# Altium schematic sheet Sheet1.SchDoc
size A2
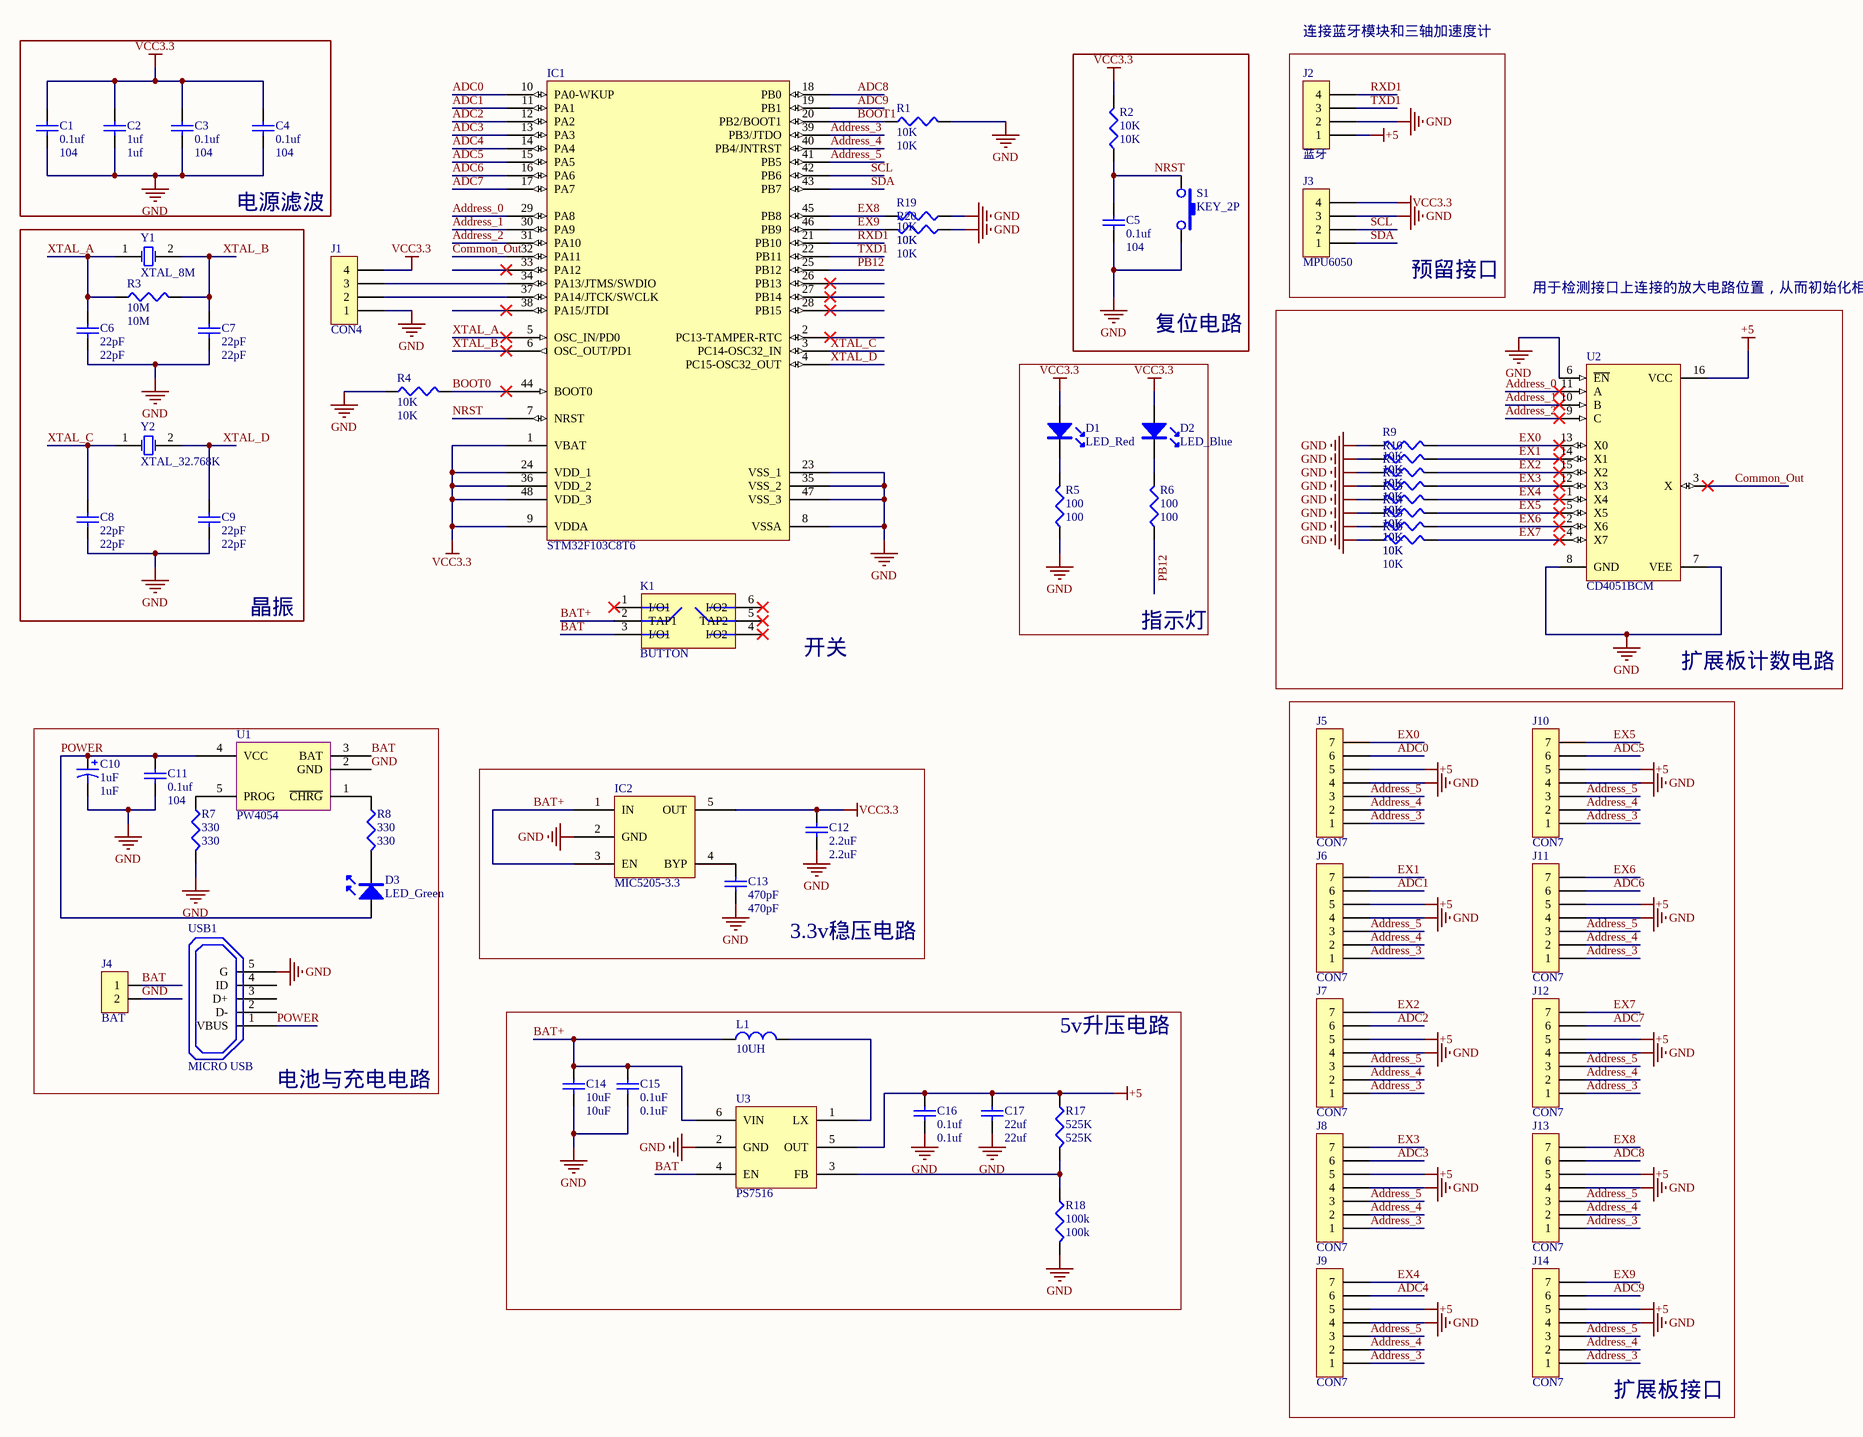
[diagram p0: Sheet1.SchDoc]

## Parts
C1  0.1uf  value 104  [6-0805_L]
C2  1uf  [6-0805_L]
C3  0.1uf  value 104  [6-0805_L]
C4  0.1uf  value 104  [6-0805_L]
C5  0.1uf  value 104  [6-0805_L]
C6  22pF  [6-0805_L]
C7  22pF  [6-0805_L]
C8  22pF  [6-0805_L]
C9  22pF  [6-0805_L]
C10  1uF  [C0805]
C11  0.1uf  value 104  [6-0805_L]
C12  2.2uF  [6-0805_L]
C13  470pF  [6-0805_L]
C14  10uF  [6-0805_L]
C15  0.1uF  [6-0805_L]
C16  0.1uf  [6-0805_L]
C17  22uf  [6-0805_L]
D1  LED_Red  [6-0805_M]
D2  LED_Blue  [6-0805_M]
D3  LED_Green  [6-0805_M]
IC1  STM32F103C8T6  [LQFP48]
IC2  MIC5205-3.3  [SOT-23-5]
J1  CON4  [HDR1X4]
J2  蓝牙  [HDR1X4]
J3  MPU6050  [HDR1X4]
J4  BAT  [HDR1X2]
J5  CON7  [HDR1X7]
J6  CON7  [HDR1X7]
J7  CON7  [HDR1X7]
J8  CON7  [HDR1X7]
J9  CON7  [HDR1X7]
J10  CON7  [HDR1X7]
J11  CON7  [HDR1X7]
J12  CON7  [HDR1X7]
J13  CON7  [HDR1X7]
J14  CON7  [HDR1X7]
K1  BUTTON  [switch]
L1  10UH  [0850]
R1  10K  [6-0805_L]
R2  10K  [6-0805_L]
R3  10M  [6-0805_L]
R4  10K  [6-0805_L]
R5  100  [6-0805_L]
R6  100  [6-0805_L]
R7  330  [6-0805_L]
R8  330  [6-0805_L]
R9  10K  [6-0805_L]
R10  10K  [6-0805_L]
R11  10K  [6-0805_L]
R12  10K  [6-0805_L]
R13  10K  [6-0805_L]
R14  10K  [6-0805_L]
R15  10K  [6-0805_L]
R16  10K  [6-0805_L]
R17  525K  [6-0805_L]
R18  100k  [6-0805_L]
R19  10K  [6-0805_L]
R20  10K  [6-0805_L]
S1  KEY_2P  [button]
U1  PW4054  [SOT-23-CT5_L]
U2  CD4051BCM  [M16A_N]
U3  PS7516  [SOT23-6_M]
USB1  MICRO USB  [MICRO USB]
Y1  XTAL_8M  [xtal]
Y2  XTAL_32.768K  [R38]

## Blocks framed on the sheet
电源滤波: C1-C4
复位电路: C5 R2 S1
预留接口: J2 J3
晶振: C6-C9 R3 Y1 Y2
扩展板计数电路: R9-R16 U2
指示灯: D1 D2 R5 R6
电池与充电电路: C10 C11 D3 J4 R7 R8 U1 USB1
扩展板接口: J5-J14
3.3v稳压电路: C12 C13 IC2
5v升压电路: C14-C17 L1 R17 R18 U3

## Nets
+5: C16.2 C17.2 J2.1 J5.5 J6.5 J7.5 J8.5 J9.5 J10.5 J11.5 J12.5 J13.5 J14.5 R17.1 U2.16(VCC) U3.5(OUT)
GND: C1.1 C2.1 C3.1 C4.1 C5.1 C6.1 C7.1 C8.1 C9.1 C10.2 C11.1 C12.1 C13.1 C14.1 C15.1 C16.1 C17.1 IC1.8(VSSA) IC1.23(VSS_1) IC1.35(VSS_2) IC1.47(VSS_3) IC2.2(GND) J1.1 J2.2 J3.3 J4.2 J5.4 J6.4 J7.4 J8.4 J9.4 J10.4 J11.4 J12.4 J13.4 J14.4 R1.2 R4.1 R5.1 R7.2 R9.1 R10.1 R11.1 R12.1 R13.1 R14.1 R15.1 R16.1 R18.2 R19.1 R20.1 S1.2 U1.2(GND) U2.6(~{EN}) U2.7(VEE) U2.8(GND) U3.2(GND) USB1.5(G)
VCC3.3: C1.2 C2.2 C3.2 C4.2 C12.2 D1.1 D2.1 IC1.1(VBAT) IC1.9(VDDA) IC1.24(VDD_1) IC1.36(VDD_2) IC1.48(VDD_3) IC2.5(OUT) J1.4 J3.4 R2.2
ADC0: IC1.10(PA0-WKUP) J5.6
ADC1: IC1.11(PA1) J6.6
ADC2: IC1.12(PA2) J7.6
ADC3: IC1.13(PA3) J8.6
ADC4: IC1.14(PA4) J9.6
ADC5: IC1.15(PA5) J10.6
ADC6: IC1.16(PA6) J11.6
ADC7: IC1.17(PA7) J12.6
ADC8: IC1.18(PB0) J13.6
ADC9: IC1.19(PB1) J14.6
Address_0: IC1.29(PA8) U2.11(A)
Address_1: IC1.30(PA9) U2.10(B)
Address_2: IC1.31(PA10) U2.9(C)
Address_3: IC1.39(PB3/JTDO) J5.1 J6.1 J7.1 J8.1 J9.1 J10.1 J11.1 J12.1 J13.1 J14.1
Address_4: IC1.40(PB4/JNTRST) J5.2 J6.2 J7.2 J8.2 J9.2 J10.2 J11.2 J12.2 J13.2 J14.2
Address_5: IC1.41(PB5) J5.3 J6.3 J7.3 J8.3 J9.3 J10.3 J11.3 J12.3 J13.3 J14.3
BAT: J4.1 K1.3(I/O1) U1.3(BAT) U3.4(EN)
BAT+: C14.2 C15.2 IC2.1(IN) IC2.3(EN) K1.2(TAP1) L1.1 U3.6(VIN)
BOOT0: IC1.44(BOOT0) R4.2
BOOT1: IC1.20(PB2/BOOT1) R1.1
Common_Out: IC1.32(PA11) U2.3(X)
EX0: J5.7 R9.2 U2.13(X0)
EX1: J6.7 R10.2 U2.14(X1)
EX2: J7.7 R11.2 U2.15(X2)
EX3: J8.7 R12.2 U2.12(X3)
EX4: J9.7 R13.2 U2.1(X4)
EX5: J10.7 R14.2 U2.5(X5)
EX6: J11.7 R15.2 U2.2(X6)
EX7: J12.7 R16.2 U2.4(X7)
EX8: IC1.45(PB8) J13.7 R19.2
EX9: IC1.46(PB9) J14.7 R20.2
NRST: C5.2 IC1.7(NRST) R2.1 S1.1
PB12: IC1.25(PB12) R6.1
POWER: C10.1 C11.2 D3.1 U1.4(VCC) USB1.1(VBUS)
RXD1: IC1.21(PB10) J2.4
SCL: IC1.42(PB6) J3.2
SDA: IC1.43(PB7) J3.1
TXD1: IC1.22(PB11) J2.3
XTAL_A: C6.2 IC1.5(OSC_IN/PD0) R3.1 Y1.1(OSC1)
XTAL_B: C7.2 IC1.6(OSC_OUT/PD1) R3.2 Y1.2(OSC2)
XTAL_C: C8.2 IC1.3(PC14-OSC32_IN) Y2.1(OSC1)
XTAL_D: C9.2 IC1.4(PC15-OSC32_OUT) Y2.2(OSC2)
NetC13_2: C13.2 IC2.4(BYP)
NetD1_2: D1.2 R5.2
NetD2_2: D2.2 R6.2
NetD3_2: D3.2 R8.2
NetIC1_34: IC1.34(PA13/JTMS/SWDIO) J1.3
NetIC1_37: IC1.37(PA14/JTCK/SWCLK) J1.2
NetL1_2: L1.2 U3.1(LX)
NetR7_1: R7.1 U1.5(PROG)
NetR8_1: R8.1 U1.1(~{CHRG})
NetR17_2: R17.2 R18.1 U3.3(FB)

Not connected (* = marked no-connect by the designer): IC1 2(PC13-TAMPER-RTC)* 26(PB13)* 27(PB14)* 28(PB15)* 33(PA12)* 38(PA15/JTDI)*; K1 1(I/O1)* 4(I/O2)* 5(TAP2)* 6(I/O2)*; USB1 2(D-) 3(D+) 4(ID)

## Notes on the sheet
- 连接蓝牙模块和三轴加速度计
- 用于检测接口上连接的放大电路位置，从而初始化相对应的ADC通道
- 开关
- Title
- Size:
- Date:
- File:
- A2
- Number:
- Time:
- Revision:
- Sheet
- of

## Library data of the parts
C1-C9 C11-C17 = Cap Semi: Capacitor (Semiconductor SIM Model); Published: 8-Jun-2000; LatestRevisionDate: 29-May-2009; LatestRevisionNote: IPC-7351 Footprint Added.; PackageReference: C1206; Publisher: Altium Limited; PackageDescription: Chip Capacitor
  C2: Value: 1uf
  C6-C9: Value: 22pF
  C12: Value: 2.2uF
  C13: Value: 470pF
  C14: Value: 10uF
  C15: Value: 0.1uF
  C16: Value: 0.1uf
  C17: Value: 22uf
C10 = Cap Pol3: Polarized Capacitor (Surface Mount); Published: 8-Jun-2000; LatestRevisionDate: 29-May-2009; LatestRevisionNote: IPC-7351 Footprint Added.; PackageReference: C0805; Publisher: Altium Limited; PackageDescription: Chip Capacitor; Value: 1uF
D1-D3 = LED
IC1 = STM32F103C8T6: 单片机; Published: 30-May-2008; DatasheetVersion: rev6, Mar-2008; PackageVersion: Mar-2008; PackageReference: LQFP48; Publisher: Altium Limited; PackageDescription: 48-Pin Low-Profile Quad Flat Pack, 7 x 7 mm Body, 0.5 mm Pitch (LQFP48); ComponentLink1Description: Manufacturer Link; ComponentLink1URL: www.st.com/stm32; ComponentLink2Description: Datasheet; ComponentLink2URL: http://www.st.com/stonline/products/literature/ds/13587.pdf
IC2 = MIC5205-3.3: 稳压
J1 = CON4: 连接器
J2 J3 = CON4: Connector
J4 = CON2: Conjunctor
J5-J14 = CON7: Connector
K1 = BUTTON: 自锁按键
L1 = Inductor: 电感
R1-R20 = Res3: Resistor; Published: 8-Jun-2000; LatestRevisionDate: 29-May-2009; LatestRevisionNote: IPC-7351 Footprint Added.; PackageReference: J1-0603; Publisher: Altium Limited; PackageDescription: Chip Resistor
  R1 R2 R4 R9-R16 R19 R20: Value: 10K
  R3: Value: 10M
  R5 R6: Value: 100
  R7 R8: Value: 330
  R17: Value: 525K
  R18: Value: 100k
S1 = KEY_2P: 轻触按键2P
U2 = CD4051BCM: 8-Channel Analog Multiplexer/Demultiplexer; Published: 17-Jul-2002; LatestRevisionDate: 13-Apr-2006; LatestRevisionNote: IPC-7351 Footprint Added.; DatasheetVersion: Jan-1999; PackageVersion: 2000; PackageReference: M16A; Publisher: Altium Limited; PackageDescription: 16-Pin Small Outline Integrated Circuit 1.27 mm Pitch; Code_IPC: SOIC127P600-16; ComponentLink1Description: Manufacturer Link; ComponentLink1URL: http://www.fairchildsemi.com/; ComponentLink2Description: Datasheet; ComponentLink2URL: http://www.fairchildsemi.com/ds/CD%2FCD4052BC.pdf
Y1 Y2 = XTAL: Crystal Oscillator; Published: 8-Jun-2000; LatestRevisionDate: 17-Jul-2002; LatestRevisionNote: Re-released for DXP Platform.; PackageReference: R38; Publisher: Altium Limited; PackageDescription: Crystal, Thru-Hole; 2 Leads; Body 3.1 x 8.2 mm (Dia.xH)